# EAGLE schematic AND (EAGLE 7.4.0)
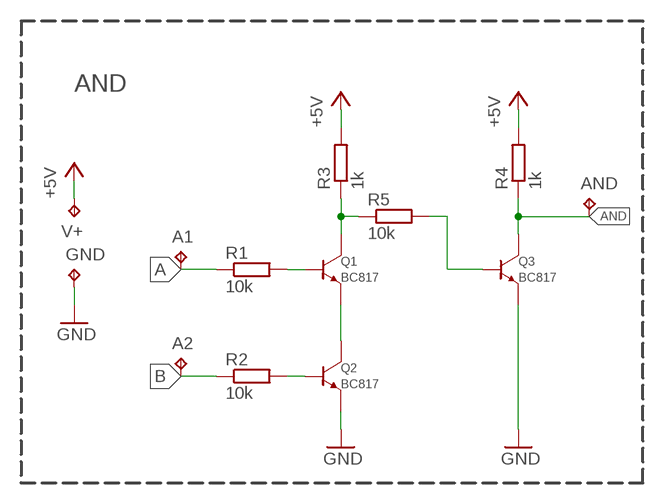
[diagram p0: schematic, sheet 1]

## Parts
A1  TPTP07R  [TP07R]
A2  TPTP07R  [TP07R]
AND  TPTP07R  [TP07R]
GND  TPTP07R  [TP07R]
Q1  BC817  TRANSISTOR-NPN-GENERICDEFAULT-SOT23-BEC  [SOT23]
Q2  BC817  TRANSISTOR-NPN-GENERICDEFAULT-SOT23-BEC  [SOT23]
Q3  BC817  TRANSISTOR-NPN-GENERICDEFAULT-SOT23-BEC  [SOT23]
R1  10k  R-EU_R0603  [R0603]
R2  10k  R-EU_R0603  [R0603]
R3  1k  R-EU_R0603  [R0603]
R4  1k  R-EU_R0603  [R0603]
R5  10k  R-EU_R0603  [R0603]
V+  TPTP07R  [TP07R]

## Nets
+5V: R3.2 R4.2 V+.TP
A: A1.TP R1.1
AND: AND.TP Q3.P$3(COLLECTOR) R4.1
B: A2.TP R2.1
GND: GND.TP Q2.P$2(EMITTER) Q3.P$2(EMITTER)
N$1: Q1.P$1(BASE) R1.2
N$2: Q1.P$3(COLLECTOR) R3.1 R5.1
N$3: Q2.P$1(BASE) R2.2
N$4: Q1.P$2(EMITTER) Q2.P$3(COLLECTOR)
N$15: Q3.P$1(BASE) R5.2

## Notes on the sheet
- AND

## Library data of the parts
A1 A2 AND GND V+ = testpad:TP: Test pad
Q1-Q3 = p.peter-scoville.tests:TRANSISTOR-NPN-GENERIC; SV_SPICE_MODEL: NPN (); SV_SPICE_ORDER: COLLECTOR;BASE;EMITTER; SV_SPICE_PREFIX: Q
R1-R5 = p.peter-scoville.tests:R-EU_: RESISTOR, European symbol; SV_SPICE_ORDER: 1;2; SV_SPICE_PREFIX: R